# EAGLE schematic CPU Board (EAGLE 6.4)
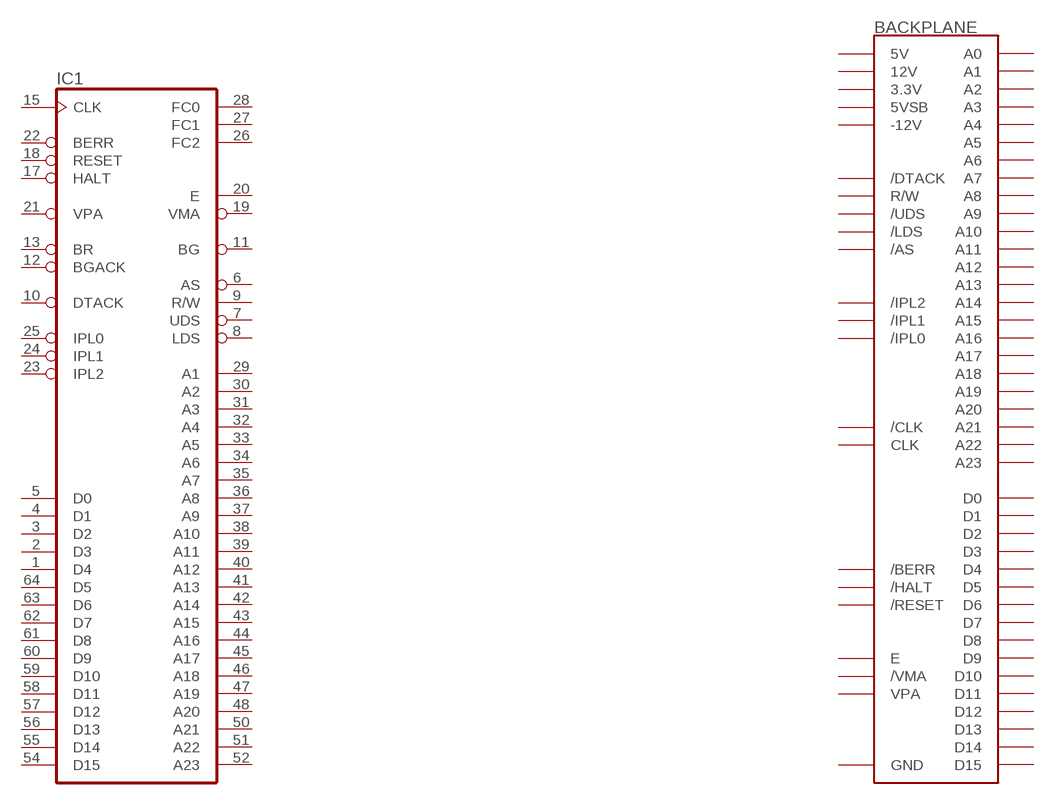
[diagram p0: schematic, sheet 1]

## Parts
BACKPLANE  BLANKBOARD  [BLANKBOARD]
IC1  MC68000P  [DIL64]
Unconnected: BACKPLANE.3V3(3.3V) BACKPLANE.5V BACKPLANE.5VSB BACKPLANE.12V BACKPLANE.-12V BACKPLANE./AS BACKPLANE./BERR BACKPLANE./CLK BACKPLANE./DTACK BACKPLANE./HALT BACKPLANE./IPL0 BACKPLANE./IPL1 BACKPLANE./IPL2 BACKPLANE./LDS BACKPLANE./RESET BACKPLANE./UDS BACKPLANE./VMA BACKPLANE.A0 BACKPLANE.A1 BACKPLANE.A2 BACKPLANE.A3 BACKPLANE.A4 BACKPLANE.A5 BACKPLANE.A6 BACKPLANE.A7 BACKPLANE.A8 BACKPLANE.A9 BACKPLANE.A10 BACKPLANE.A11 BACKPLANE.A12 BACKPLANE.A13 BACKPLANE.A14 BACKPLANE.A15 BACKPLANE.A16 BACKPLANE.A17 BACKPLANE.A18 BACKPLANE.A19 BACKPLANE.A20 BACKPLANE.A21 BACKPLANE.A22 BACKPLANE.A23 BACKPLANE.CLK BACKPLANE.D0 BACKPLANE.D1 BACKPLANE.D2 BACKPLANE.D3 BACKPLANE.D4 BACKPLANE.D5 BACKPLANE.D6 BACKPLANE.D7 BACKPLANE.D8 BACKPLANE.D9 BACKPLANE.D10 BACKPLANE.D11 BACKPLANE.D12 BACKPLANE.D13 BACKPLANE.D14 BACKPLANE.D15 BACKPLANE.E BACKPLANE.GND BACKPLANE.R/W BACKPLANE.VPA IC1.1(D4) IC1.2(D3) IC1.3(D2) IC1.4(D1) IC1.5(D0) IC1.6(AS) IC1.7(UDS) IC1.8(LDS) IC1.9(R/W) IC1.10(DTACK) IC1.11(BG) IC1.12(BGACK) IC1.13(BR) IC1.15(CLK) IC1.17(HALT) IC1.18(RESET) IC1.19(VMA) IC1.20(E) IC1.21(VPA) IC1.22(BERR) IC1.23(IPL2) IC1.24(IPL1) IC1.25(IPL0) IC1.26(FC2) IC1.27(FC1) IC1.28(FC0) IC1.29(A1) IC1.30(A2) IC1.31(A3) IC1.32(A4) IC1.33(A5) IC1.34(A6) IC1.35(A7) IC1.36(A8) IC1.37(A9) IC1.38(A10) IC1.39(A11) IC1.40(A12) IC1.41(A13) IC1.42(A14) IC1.43(A15) IC1.44(A16) IC1.45(A17) IC1.46(A18) IC1.47(A19) IC1.48(A20) IC1.50(A21) IC1.51(A22) IC1.52(A23) IC1.54(D15) IC1.55(D14) IC1.56(D13) IC1.57(D12) IC1.58(D11) IC1.59(D10) IC1.60(D9) IC1.61(D8) IC1.62(D7) IC1.63(D6) IC1.64(D5)

## Power pins joined to a net without a drawn wire
GND: IC1.16(GND) IC1.53(GND)
VCC: IC1.14(VCC) IC1.49(VCC)

## Library data of the parts
BACKPLANE = Benchoff:BLANKBOARD
IC1 = micro-mc68000:MC68000P: 68xxx PROCESSOR; OC_FARNELL: unknown; OC_NEWARK: unknown